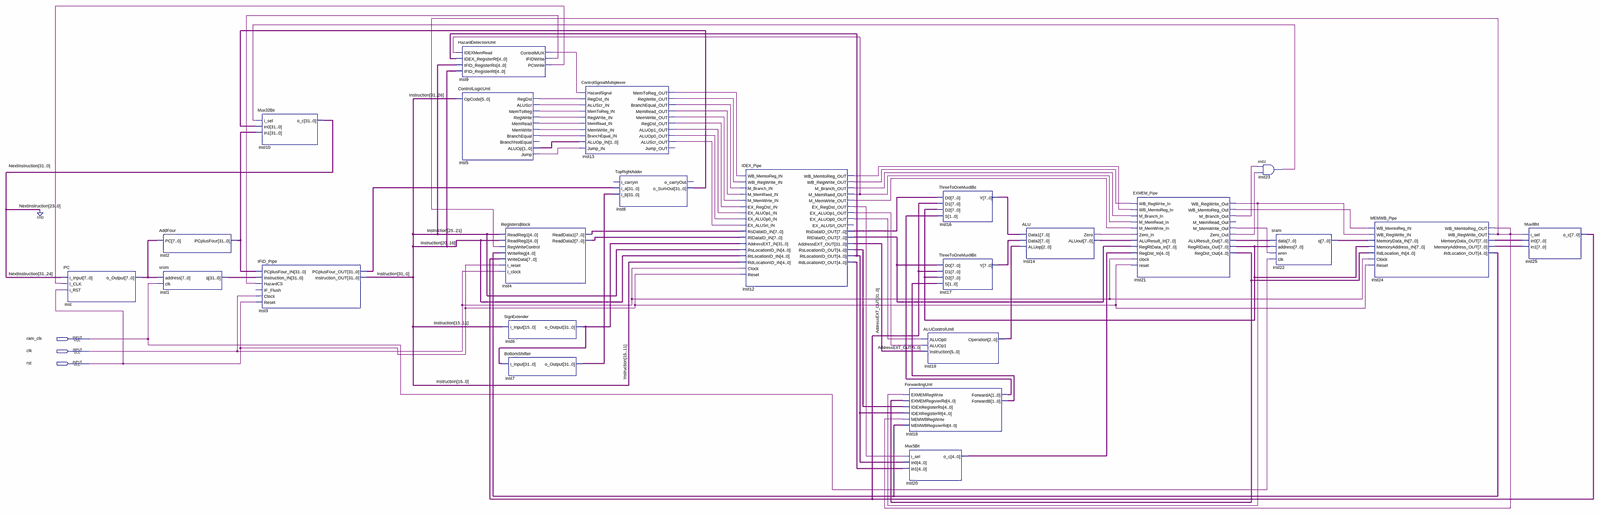
[diagram p0: schematic sheet, whole]
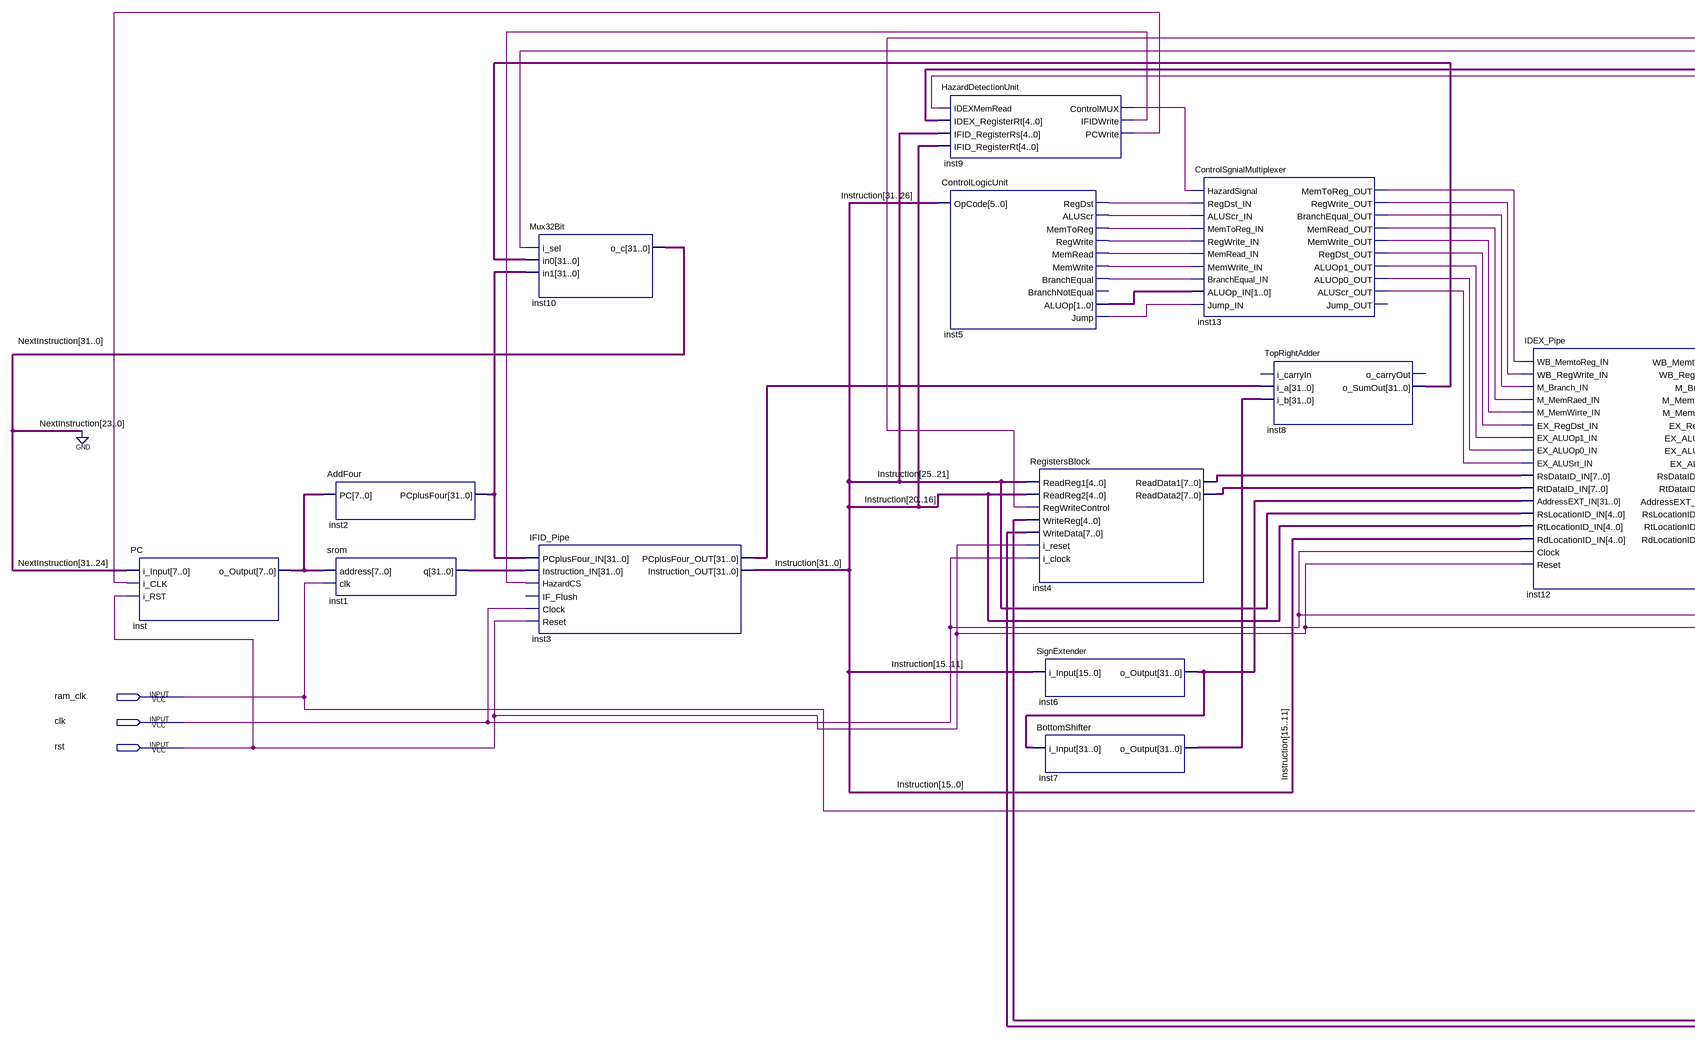
[diagram p1: schematic sheet, left part]
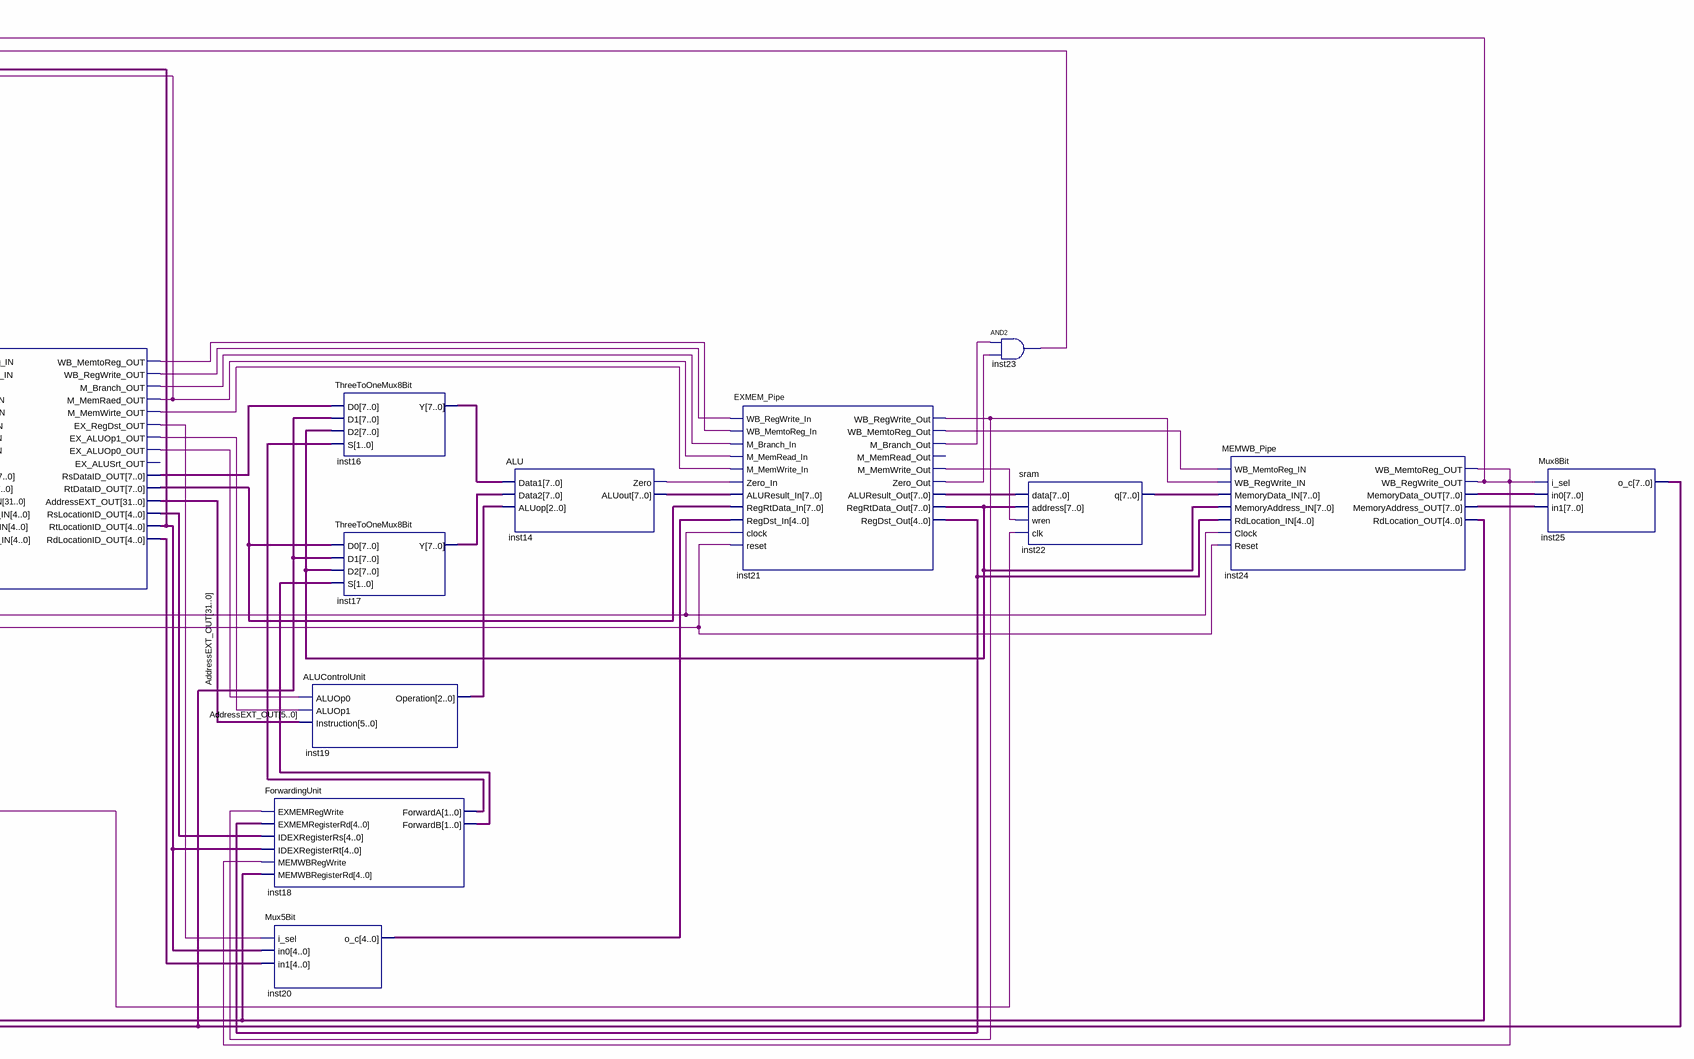
[diagram p2: schematic sheet, right part]
// Quartus schematic PipelinedProcessor.bdf as structural Verilog: 24 symbols, 3 pins
module PipelinedProcessor (
  input  ram_clk,
  input  clk,
  input  rst
);

  wire inst5_aluscr, inst5_branchequal, inst5_jump, inst5_memread, inst5_memtoreg, inst5_memwrite,
       inst5_regdst, inst5_regwrite, inst9_controlmux, inst9_ifidwrite, inst9_pcwrite, inst12_ex_aluop0_out,
       inst12_ex_aluop1_out, inst12_ex_regdst_out, inst12_m_branch_out, inst12_m_memraed_out,
       inst12_m_memwirte_out, inst12_wb_memtoreg_out, inst12_wb_regwrite_out, inst13_aluop0_out,
       inst13_aluop1_out, inst13_aluscr_out, inst13_branchequal_out, inst13_memread_out, inst13_memtoreg_out,
       inst13_memwrite_out, inst13_regdst_out, inst13_regwrite_out, inst14_zero, inst21_m_branch_out,
       inst21_m_memwrite_out, inst21_wb_memtoreg_out, inst21_wb_regwrite_out, inst21_zero_out, inst23_out,
       inst24_wb_memtoreg_out;
  wire [1:0] inst5_aluop, inst18_forwarda, inst18_forwardb;
  wire [2:0] inst19_operation;
  wire [4:0] inst12_rdlocationid_out, inst12_rslocationid_out, inst12_rtlocationid_out, inst20_o_c,
       inst21_regdst_out, inst24_rdlocation_out;
  wire [7:0] inst4_readdata1, inst4_readdata2, inst12_rsdataid_out, inst12_rtdataid_out, inst14_aluout,
       inst16_y, inst17_y, inst21_aluresult_out, inst21_regrtdata_out, inst22_q, inst24_memoryaddress_out,
       inst24_memorydata_out, inst25_o_c, inst_o_output;
  wire [31:0] AddressEXT_OUT, inst1_q, inst2_pcplusfour, inst3_pcplusfour_out, inst6_o_output,
       inst7_o_output, inst8_o_sumout, Instruction, NextInstruction;

  PC inst (.i_Input(NextInstruction[31:24]), .i_CLK(inst9_pcwrite), .i_RST(rst), .o_Output(inst_o_output));
  AddFour inst2 (.PC(inst_o_output), .PCplusFour(inst2_pcplusfour));
  srom inst1 (.address(inst_o_output), .clk(ram_clk), .q(inst1_q));
  Mux32Bit inst10 (.i_sel(inst23_out), .in0(inst8_o_sumout), .in1(inst2_pcplusfour), .o_c(NextInstruction));
  IFID_Pipe inst3 (
    .PCplusFour_IN(inst2_pcplusfour), .Instruction_IN(inst1_q), .HazardCS(inst9_ifidwrite), .Clock(clk),
    .Reset(rst), .PCplusFour_OUT(inst3_pcplusfour_out), .Instruction_OUT(Instruction));  // open: IF_Flush
  HazardDetectionUnit inst9 (
    .IDEXMemRead(inst12_m_memraed_out), .IDEX_RegisterRt(inst12_rtlocationid_out),
    .IFID_RegisterRs(Instruction), .IFID_RegisterRt(Instruction[20:16]), .ControlMUX(inst9_controlmux),
    .IFIDWrite(inst9_ifidwrite), .PCWrite(inst9_pcwrite));
  ControlLogicUnit inst5 (
    .OpCode(Instruction[31:26]), .RegDst(inst5_regdst), .ALUScr(inst5_aluscr), .MemToReg(inst5_memtoreg),
    .RegWrite(inst5_regwrite), .MemRead(inst5_memread), .MemWrite(inst5_memwrite),
    .BranchEqual(inst5_branchequal), .ALUOp(inst5_aluop), .Jump(inst5_jump));  // open: BranchNotEqual
  RegistersBlock inst4 (
    .ReadReg1(Instruction[25:21]), .ReadReg2(Instruction[20:16]), .RegWriteControl(inst24_wb_memtoreg_out),
    .WriteReg(inst24_rdlocation_out), .WriteData(inst25_o_c), .i_reset(rst), .i_clock(clk),
    .ReadData1(inst4_readdata1), .ReadData2(inst4_readdata2));
  SignExtender inst6 (.i_Input(Instruction[15:11]), .o_Output(inst6_o_output));
  BottomShifter inst7 (.i_Input(inst6_o_output), .o_Output(inst7_o_output));
  ControlSgnialMultiplexer inst13 (
    .HazardSignal(inst9_controlmux), .RegDst_IN(inst5_regdst), .ALUScr_IN(inst5_aluscr),
    .MemToReg_IN(inst5_memtoreg), .RegWrite_IN(inst5_regwrite), .MemRead_IN(inst5_memread),
    .MemWrite_IN(inst5_memwrite), .BranchEqual_IN(inst5_branchequal), .ALUOp_IN(inst5_aluop),
    .Jump_IN(inst5_jump), .MemToReg_OUT(inst13_memtoreg_out), .RegWrite_OUT(inst13_regwrite_out),
    .BranchEqual_OUT(inst13_branchequal_out), .MemRead_OUT(inst13_memread_out),
    .MemWrite_OUT(inst13_memwrite_out), .RegDst_OUT(inst13_regdst_out), .ALUOp1_OUT(inst13_aluop1_out),
    .ALUOp0_OUT(inst13_aluop0_out), .ALUScr_OUT(inst13_aluscr_out));  // open: Jump_OUT
  TopRightAdder inst8 (
    .i_a(inst3_pcplusfour_out), .i_b(inst7_o_output), .o_SumOut(inst8_o_sumout));  // open: i_carryIn, o_carryOut
  IDEX_Pipe inst12 (
    .WB_MemtoReg_IN(inst13_memtoreg_out), .WB_RegWrite_IN(inst13_regwrite_out),
    .M_Branch_IN(inst13_branchequal_out), .M_MemRaed_IN(inst13_memread_out),
    .M_MemWirte_IN(inst13_memwrite_out), .EX_RegDst_IN(inst13_regdst_out), .EX_ALUOp1_IN(inst13_aluop1_out),
    .EX_ALUOp0_IN(inst13_aluop0_out), .EX_ALUSrt_IN(inst13_aluscr_out), .RsDataID_IN(inst4_readdata1),
    .RtDataID_IN(inst4_readdata2), .AddressEXT_IN(inst6_o_output), .RsLocationID_IN(Instruction[25:21]),
    .RtLocationID_IN(Instruction[20:16]), .RdLocationID_IN(Instruction[15:11]), .Clock(clk), .Reset(rst),
    .WB_MemtoReg_OUT(inst12_wb_memtoreg_out), .WB_RegWrite_OUT(inst12_wb_regwrite_out),
    .M_Branch_OUT(inst12_m_branch_out), .M_MemRaed_OUT(inst12_m_memraed_out),
    .M_MemWirte_OUT(inst12_m_memwirte_out), .EX_RegDst_OUT(inst12_ex_regdst_out),
    .EX_ALUOp1_OUT(inst12_ex_aluop1_out), .EX_ALUOp0_OUT(inst12_ex_aluop0_out),
    .RsDataID_OUT(inst12_rsdataid_out), .RtDataID_OUT(inst12_rtdataid_out), .AddressEXT_OUT(AddressEXT_OUT),
    .RsLocationID_OUT(inst12_rslocationid_out), .RtLocationID_OUT(inst12_rtlocationid_out),
    .RdLocationID_OUT(inst12_rdlocationid_out));  // open: EX_ALUSrt_OUT
  ForwardingUnit inst18 (
    .EXMEMRegWrite(inst21_wb_regwrite_out), .EXMEMRegisterRd(inst21_regdst_out),
    .IDEXRegisterRs(inst12_rslocationid_out), .IDEXRegisterRt(inst12_rtlocationid_out),
    .MEMWBRegWrite(inst24_wb_memtoreg_out), .MEMWBRegisterRd(inst24_rdlocation_out),
    .ForwardA(inst18_forwarda), .ForwardB(inst18_forwardb));
  Mux5Bit inst20 (
    .i_sel(inst12_ex_regdst_out), .in0(inst12_rtlocationid_out), .in1(inst12_rdlocationid_out),
    .o_c(inst20_o_c));
  ThreeToOneMux8Bit inst16 (
    .D0(inst12_rsdataid_out), .D1(inst25_o_c), .D2(inst21_regrtdata_out), .S(inst18_forwarda), .Y(inst16_y));
  ThreeToOneMux8Bit inst17 (
    .D0(inst12_rtdataid_out), .D1(inst25_o_c), .D2(inst21_regrtdata_out), .S(inst18_forwardb), .Y(inst17_y));
  ALUControlUnit inst19 (
    .ALUOp0(inst12_ex_aluop0_out), .ALUOp1(inst12_ex_aluop1_out), .Instruction(AddressEXT_OUT[5:0]),
    .Operation(inst19_operation));
  ALU inst14 (.Data1(inst16_y), .Data2(inst17_y), .ALUop(inst19_operation), .Zero(inst14_zero), .ALUout(inst14_aluout));
  EXMEM_Pipe inst21 (
    .WB_RegWrite_In(inst12_wb_regwrite_out), .WB_MemtoReg_In(inst12_wb_memtoreg_out),
    .M_Branch_In(inst12_m_branch_out), .M_MemRead_In(inst12_m_memraed_out),
    .M_MemWrite_In(inst12_m_memwirte_out), .Zero_In(inst14_zero), .ALUResult_In(inst14_aluout),
    .RegRtData_In(inst12_rtdataid_out), .RegDst_In(inst20_o_c), .clock(clk), .reset(rst),
    .WB_RegWrite_Out(inst21_wb_regwrite_out), .WB_MemtoReg_Out(inst21_wb_memtoreg_out),
    .M_Branch_Out(inst21_m_branch_out), .M_MemWrite_Out(inst21_m_memwrite_out), .Zero_Out(inst21_zero_out),
    .ALUResult_Out(inst21_aluresult_out), .RegRtData_Out(inst21_regrtdata_out), .RegDst_Out(inst21_regdst_out));  // open: M_MemRead_Out
  and inst23 (inst23_out, inst21_m_branch_out, inst21_zero_out);
  sram inst22 (
    .data(inst21_aluresult_out), .address(inst21_regrtdata_out), .wren(inst21_m_memwrite_out), .clk(ram_clk),
    .q(inst22_q));
  MEMWB_Pipe inst24 (
    .WB_MemtoReg_IN(inst21_wb_memtoreg_out), .WB_RegWrite_IN(inst21_wb_regwrite_out),
    .MemoryData_IN(inst22_q), .MemoryAddress_IN(inst21_regrtdata_out), .RdLocation_IN(inst21_regdst_out),
    .Clock(clk), .Reset(rst), .WB_MemtoReg_OUT(inst24_wb_memtoreg_out),
    .WB_RegWrite_OUT(inst24_wb_memtoreg_out), .MemoryData_OUT(inst24_memorydata_out),
    .MemoryAddress_OUT(inst24_memoryaddress_out), .RdLocation_OUT(inst24_rdlocation_out));
  Mux8Bit inst25 (
    .i_sel(inst24_wb_memtoreg_out), .in0(inst24_memorydata_out), .in1(inst24_memoryaddress_out),
    .o_c(inst25_o_c));
  // also tied to GND on the sheet: {NextInstruction[0], NextInstruction[1], NextInstruction[2], NextInstruction[3], NextInstruction[4], NextInstruction[5], NextInstruction[6], NextInstruction[7], NextInstruction[8], NextInstruction[9], NextInstruction[10], NextInstruction[11], NextInstruction[12], NextInstruction[13], NextInstruction[14], NextInstruction[15], NextInstruction[16], NextInstruction[17], NextInstruction[18], NextInstruction[19], NextInstruction[20], NextInstruction[21], NextInstruction[22], NextInstruction[23]}
endmodule
